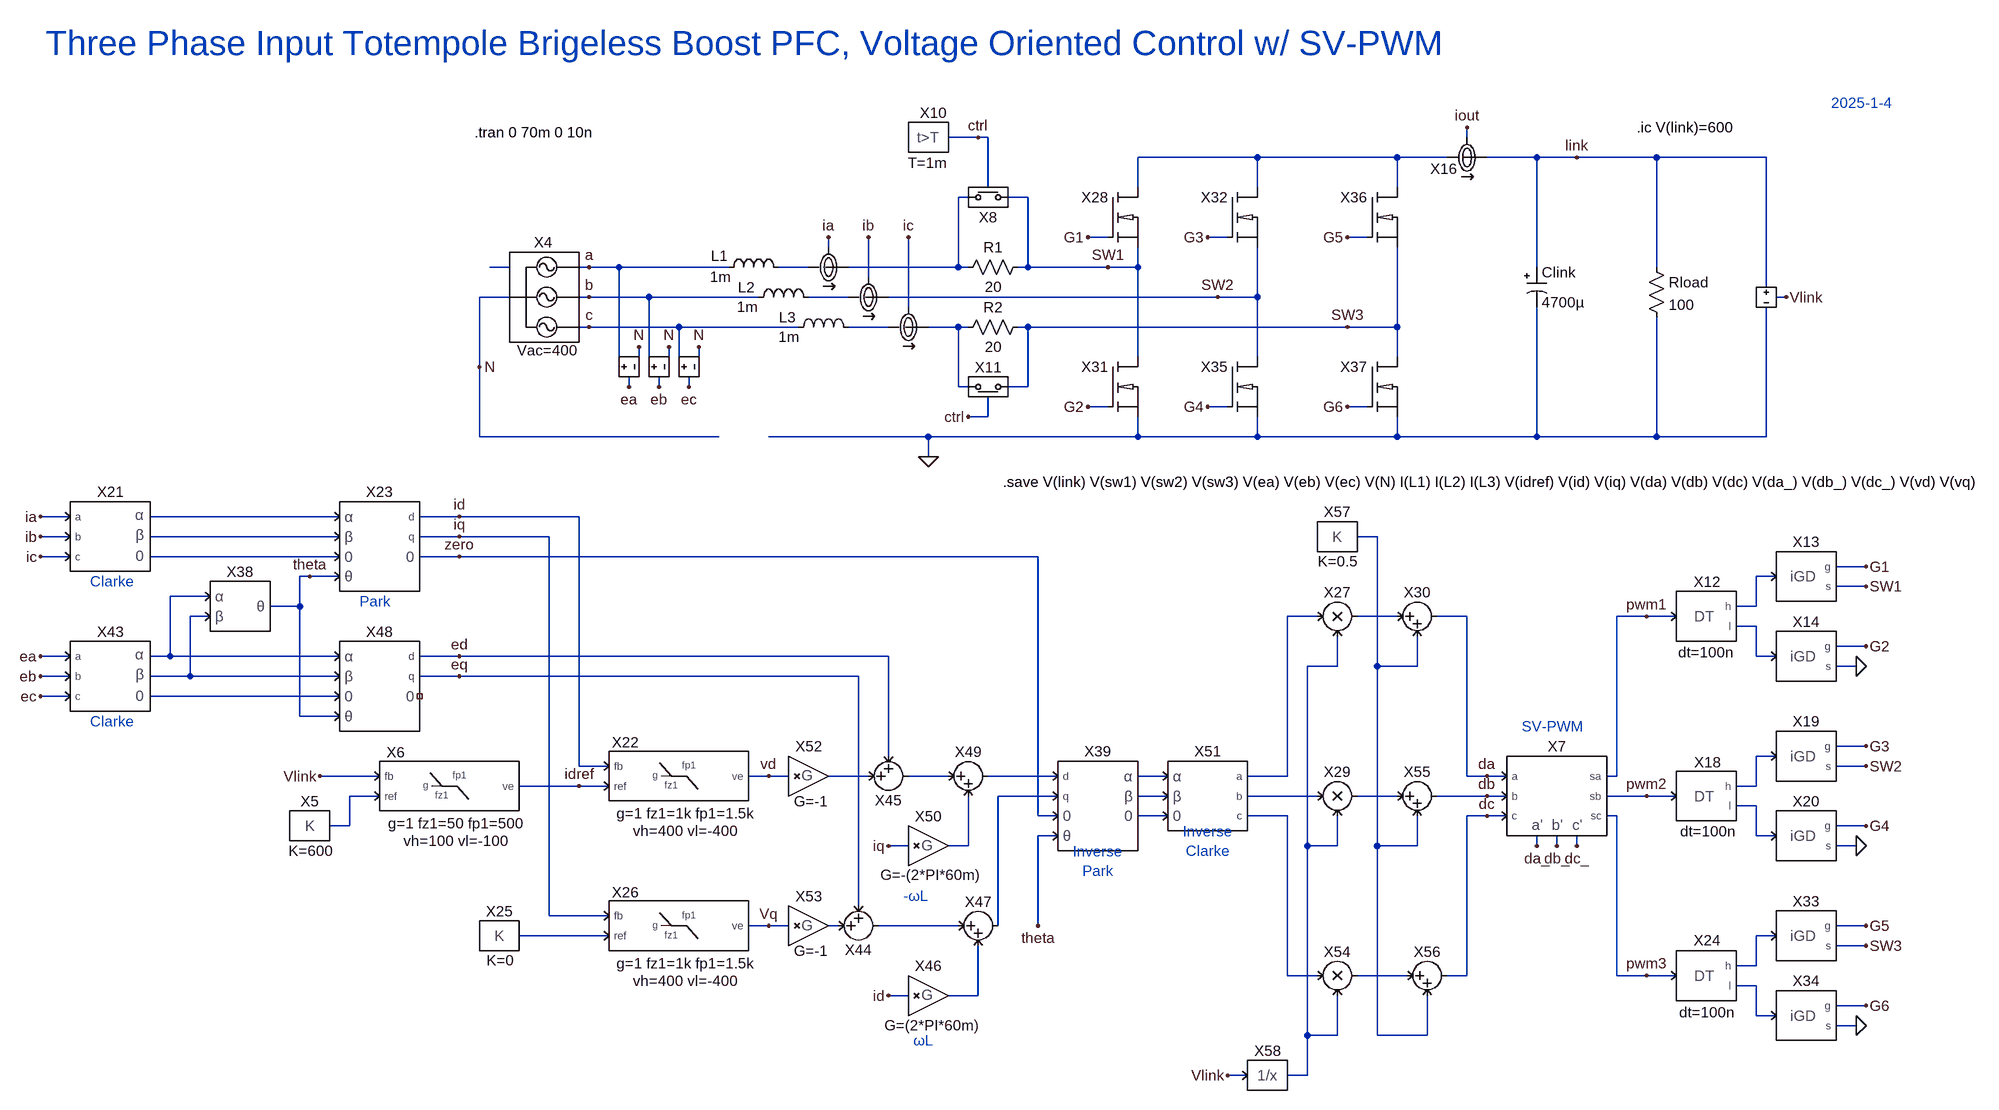
[diagram p0: schematic 3Ph-TTP-PFC_VOC_SVPWM.asc]
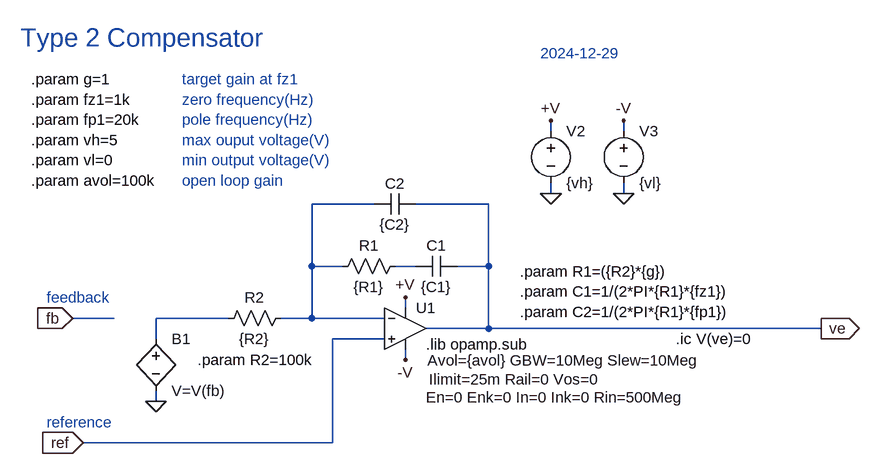
[diagram p1: sub-circuit type2.asc]
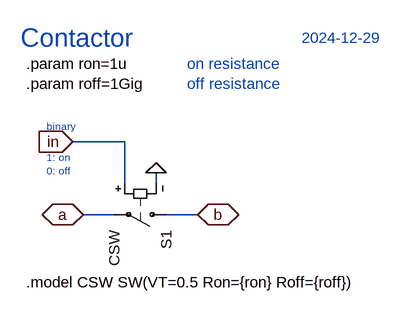
[diagram p2: sub-circuit contactor.asc]
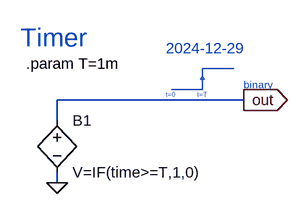
[diagram p3: sub-circuit timer.asc]
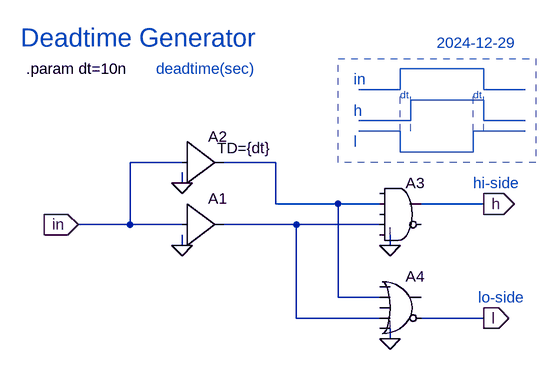
[diagram p4: sub-circuit deadtime.asc]
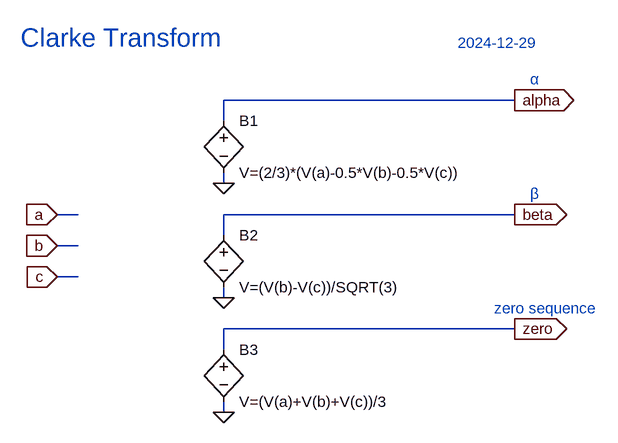
[diagram p5: sub-circuit clarke.asc]
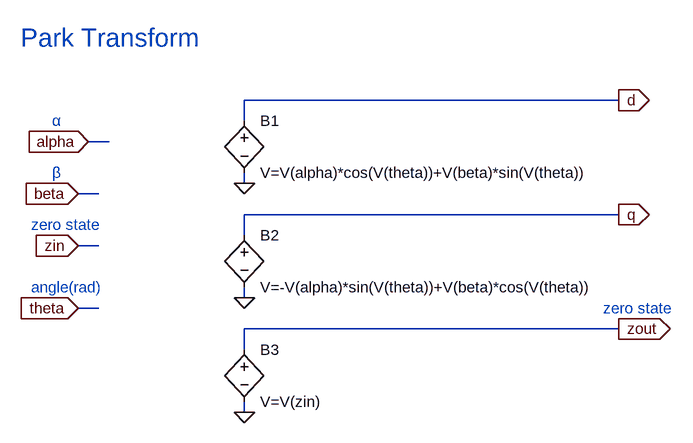
[diagram p6: sub-circuit park.asc]
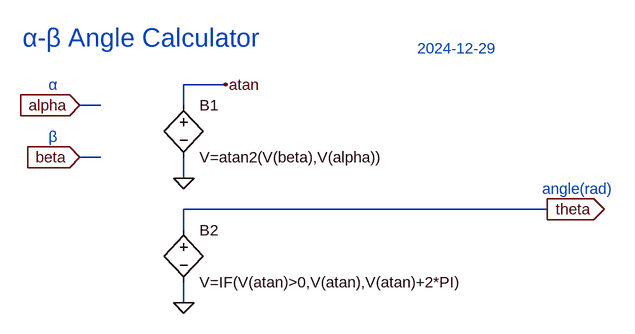
[diagram p7: sub-circuit angle.asc]
3Ph-TTP-PFC_VOC_SVPWM.asc, the LTspice schematic file:
Version 4
SHEET 1 2128 1792
WIRE 368 -48 320 -48
WIRE 384 -48 368 -48
WIRE 1152 -48 1152 -64
WIRE 816 -16 624 -16
WIRE 1040 -16 816 -16
WIRE 1120 -16 1040 -16
WIRE 1264 -16 1184 -16
WIRE 1328 -16 1264 -16
WIRE 1456 -16 1328 -16
WIRE 1632 -16 1456 -16
WIRE 384 32 384 -48
WIRE 624 32 624 -16
WIRE 816 32 816 -16
WIRE 1040 32 1040 -16
WIRE 352 48 336 48
WIRE 448 48 416 48
WIRE 576 112 544 112
WIRE 768 112 736 112
WIRE 992 112 960 112
WIRE 128 128 128 112
WIRE -384 160 -416 160
WIRE -256 160 -272 160
WIRE -208 160 -256 160
WIRE -32 160 -208 160
WIRE 96 160 48 160
WIRE 336 160 336 48
WIRE 336 160 160 160
WIRE 352 160 336 160
WIRE 448 160 448 48
WIRE 448 160 432 160
WIRE 576 160 448 160
WIRE 624 160 624 128
WIRE 624 160 576 160
WIRE 1264 160 1264 -16
WIRE 1456 160 1456 -16
WIRE 192 176 192 112
WIRE 1632 192 1632 -16
WIRE -384 208 -432 208
WIRE -256 208 -272 208
WIRE -160 208 -256 208
WIRE 16 208 -160 208
WIRE 160 208 96 208
WIRE 752 208 224 208
WIRE 816 208 816 128
WIRE 816 208 752 208
WIRE 1664 208 1648 208
WIRE 256 224 256 112
WIRE -256 256 -272 256
WIRE -112 256 -256 256
WIRE 80 256 -112 256
WIRE 224 256 160 256
WIRE 336 256 288 256
WIRE 352 256 336 256
WIRE 448 256 432 256
WIRE 960 256 448 256
WIRE 1040 256 1040 128
WIRE 1040 256 960 256
WIRE 624 304 624 160
WIRE 816 304 816 208
WIRE 1040 304 1040 256
WIRE -432 320 -432 208
WIRE -208 320 -208 160
WIRE -176 320 -176 288
WIRE -160 320 -160 208
WIRE -128 320 -128 288
WIRE -112 320 -112 256
WIRE -80 320 -80 288
WIRE -192 352 -192 336
WIRE -144 352 -144 336
WIRE -96 352 -96 336
WIRE 336 352 336 256
WIRE 352 352 336 352
WIRE 448 352 448 256
WIRE 448 352 416 352
WIRE 576 384 544 384
WIRE 768 384 736 384
WIRE 992 384 960 384
WIRE 384 400 384 368
WIRE 384 400 352 400
WIRE -432 432 -432 320
WIRE -48 432 -432 432
WIRE 288 432 32 432
WIRE 624 432 624 400
WIRE 624 432 288 432
WIRE 816 432 816 400
WIRE 816 432 624 432
WIRE 1040 432 1040 400
WIRE 1040 432 816 432
WIRE 1264 432 1264 224
WIRE 1264 432 1040 432
WIRE 1456 432 1456 240
WIRE 1456 432 1264 432
WIRE 1632 432 1632 224
WIRE 1632 432 1456 432
WIRE 288 464 288 432
WIRE -1088 560 -1136 560
WIRE -656 560 -960 560
WIRE -464 560 -528 560
WIRE -272 560 -464 560
WIRE -1088 592 -1136 592
WIRE -656 592 -960 592
WIRE -464 592 -528 592
WIRE -320 592 -464 592
WIRE 1008 592 976 592
WIRE -1088 624 -1136 624
WIRE -656 624 -960 624
WIRE -464 624 -528 624
WIRE 464 624 -464 624
WIRE 1792 640 1744 640
WIRE -704 656 -720 656
WIRE -656 656 -704 656
WIRE 1648 656 1616 656
WIRE 1792 672 1744 672
WIRE -864 688 -928 688
WIRE -720 704 -720 656
WIRE -720 704 -768 704
WIRE 1616 704 1616 656
WIRE 1616 704 1584 704
WIRE -864 720 -896 720
WIRE 912 720 864 720
WIRE 1040 720 976 720
WIRE 1152 720 1104 720
WIRE 1440 720 1392 720
WIRE 1488 720 1440 720
WIRE 1616 736 1584 736
WIRE 1792 768 1744 768
WIRE -1088 784 -1136 784
WIRE -928 784 -928 688
WIRE -928 784 -960 784
WIRE -656 784 -928 784
WIRE -464 784 -528 784
WIRE 224 784 -464 784
WIRE 1616 784 1616 736
WIRE 1648 784 1616 784
WIRE 944 800 944 752
WIRE 944 800 896 800
WIRE 1008 800 1008 592
WIRE 1072 800 1072 752
WIRE 1072 800 1008 800
WIRE 1776 800 1744 800
WIRE -1088 816 -1136 816
WIRE -896 816 -896 720
WIRE -896 816 -960 816
WIRE -656 816 -896 816
WIRE -464 816 -528 816
WIRE 176 816 -464 816
WIRE -1088 848 -1136 848
WIRE -656 848 -960 848
WIRE -720 880 -720 704
WIRE -656 880 -720 880
WIRE 1792 928 1744 928
WIRE 224 944 224 784
WIRE 1648 944 1616 944
WIRE -272 960 -272 560
WIRE -224 960 -272 960
WIRE 1792 960 1744 960
WIRE -592 976 -688 976
WIRE 32 976 0 976
WIRE 64 976 32 976
WIRE 192 976 128 976
WIRE 320 976 256 976
WIRE 496 976 384 976
WIRE 672 976 624 976
WIRE 864 976 864 720
WIRE 864 976 800 976
WIRE 1152 976 1152 720
WIRE 1184 976 1152 976
WIRE 1216 976 1184 976
WIRE 1392 976 1392 720
WIRE 1392 976 1376 976
WIRE -272 992 -368 992
WIRE -224 992 -272 992
WIRE 1616 992 1616 944
WIRE 1616 992 1584 992
WIRE -592 1008 -640 1008
WIRE 496 1008 400 1008
WIRE 672 1008 624 1008
WIRE 912 1008 800 1008
WIRE 1040 1008 976 1008
WIRE 1184 1008 1104 1008
WIRE 1216 1008 1184 1008
WIRE 1440 1008 1376 1008
WIRE 1488 1008 1440 1008
WIRE 1616 1024 1584 1024
WIRE 464 1040 464 624
WIRE 496 1040 464 1040
WIRE 672 1040 624 1040
WIRE 864 1040 800 1040
WIRE 1184 1040 1152 1040
WIRE 1216 1040 1184 1040
WIRE 1392 1040 1376 1040
WIRE -640 1056 -640 1008
WIRE -640 1056 -672 1056
WIRE 1792 1056 1744 1056
WIRE 496 1072 464 1072
WIRE 1616 1072 1616 1024
WIRE 1648 1072 1616 1072
WIRE 256 1088 224 1088
WIRE 352 1088 352 1008
WIRE 352 1088 320 1088
WIRE 896 1088 896 800
WIRE 944 1088 944 1040
WIRE 944 1088 896 1088
WIRE 1008 1088 1008 800
WIRE 1072 1088 1072 1040
WIRE 1072 1088 1008 1088
WIRE 1264 1088 1264 1072
WIRE 1296 1088 1296 1072
WIRE 1328 1088 1328 1072
WIRE 1776 1088 1744 1088
WIRE 176 1184 176 816
WIRE -320 1200 -320 592
WIRE -224 1200 -320 1200
WIRE 32 1216 0 1216
WIRE 64 1216 32 1216
WIRE 144 1216 128 1216
WIRE 336 1216 208 1216
WIRE 400 1216 400 1008
WIRE 464 1216 464 1072
WIRE 1792 1216 1744 1216
WIRE -224 1232 -368 1232
WIRE 1648 1232 1616 1232
WIRE 1792 1248 1744 1248
WIRE 1616 1280 1616 1232
WIRE 1616 1280 1584 1280
WIRE 864 1296 864 1040
WIRE 912 1296 864 1296
WIRE 1056 1296 976 1296
WIRE 1152 1296 1152 1040
WIRE 1152 1296 1120 1296
WIRE 1392 1296 1392 1040
WIRE 1440 1296 1392 1296
WIRE 1488 1296 1440 1296
WIRE 1616 1312 1584 1312
WIRE 256 1328 224 1328
WIRE 368 1328 368 1248
WIRE 368 1328 320 1328
WIRE 1792 1344 1744 1344
WIRE 1616 1360 1616 1312
WIRE 1648 1360 1616 1360
WIRE 1776 1376 1744 1376
WIRE 896 1392 896 1088
WIRE 944 1392 944 1328
WIRE 944 1392 896 1392
WIRE 1008 1392 1008 1088
WIRE 1088 1392 1088 1328
WIRE 1088 1392 1008 1392
WIRE 800 1456 768 1456
WIRE 896 1456 896 1392
WIRE 896 1456 864 1456
FLAG 544 112 G1
FLAG 544 384 G2
FLAG 576 160 SW1
FLAG 1328 -16 link
FLAG 128 112 ia
FLAG 1664 208 Vlink
FLAG -688 976 Vlink
FLAG 1440 720 pwm1
FLAG 288 464 0
FLAG 1152 -64 iout
FLAG -272 992 idref
FLAG 736 112 G3
FLAG 736 384 G4
FLAG 752 208 SW2
FLAG 960 112 G5
FLAG 960 384 G6
FLAG 960 256 SW3
FLAG 192 112 ib
FLAG 256 112 ic
FLAG -1136 560 ia
FLAG -1136 592 ib
FLAG -1136 624 ic
FLAG -464 560 id
FLAG -464 592 iq
FLAG 1440 1008 pwm2
FLAG 1440 1296 pwm3
FLAG 32 976 vd
FLAG 32 1216 Vq
FLAG -256 160 a
FLAG -256 208 b
FLAG -256 256 c
FLAG -464 624 zero
FLAG -432 320 N
FLAG 368 -48 ctrl
FLAG 352 400 ctrl
FLAG 1792 640 G1
FLAG 1792 672 SW1
FLAG 1792 768 G2
FLAG 1792 928 G3
FLAG 1792 960 SW2
FLAG 1792 1056 G4
FLAG 1792 1216 G5
FLAG 1792 1248 SW3
FLAG 1792 1344 G6
FLAG 1776 800 0
FLAG 1776 1376 0
FLAG 1776 1088 0
FLAG -704 656 theta
FLAG 464 1216 theta
FLAG -192 352 ea
FLAG -144 352 eb
FLAG -96 352 ec
FLAG -176 288 N
FLAG -128 288 N
FLAG -80 288 N
FLAG -1136 784 ea
FLAG -1136 816 eb
FLAG -1136 848 ec
FLAG 224 1328 id
FLAG 224 1088 iq
FLAG -464 784 ed
FLAG -464 816 eq
FLAG 768 1456 Vlink
FLAG 1264 1088 da_
FLAG 1296 1088 db_
FLAG 1328 1088 dc_
FLAG 1184 976 da
FLAG 1184 1008 db
FLAG 1184 1040 dc
SYMBOL ind -48 176 R270
WINDOW 0 19 1 VTop 2
WINDOW 3 16 3 VBottom 2
SYMATTR InstName L1
SYMATTR Value 1m
SYMATTR SpiceLine Rser=1m
SYMBOL polcap 1248 160 R0
WINDOW 3 24 56 Left 2
SYMATTR Value 4700µ
SYMATTR InstName Clink
SYMATTR Description Capacitor
SYMATTR Type cap
SYMATTR SpiceLine Rser=10m
SYMBOL res 1440 144 R0
SYMATTR InstName Rload
SYMATTR Value 100
SYMBOL IMON 128 160 M180
WINDOW 0 0 -26 Invisible 2
SYMATTR InstName X1
SYMBOL VMON 1632 208 R0
WINDOW 0 57 -5 Invisible 2
SYMATTR InstName X2
SYMBOL CONST -704 1056 R0
WINDOW 39 1 55 Bottom 2
SYMATTR SpiceLine K=600
SYMATTR InstName X5
SYMBOL IMON 1152 -16 M180
SYMATTR InstName X16
SYMBOL TYPE2 -480 992 R0
WINDOW 0 -86 -54 Center 2
WINDOW 39 10 60 Center 2
WINDOW 40 10 88 Center 2
SYMATTR InstName X6
SYMATTR SpiceLine g=1 fz1=50 fp1=500
SYMATTR SpiceLine2 vh=100 vl=-100
SYMBOL VAC3ph -320 208 R0
WINDOW 39 -4 101 Bottom 2
SYMATTR SpiceLine Vac=400
SYMATTR InstName X4
SYMBOL ind 0 224 R270
WINDOW 0 16 -4 VTop 2
WINDOW 3 16 -2 VBottom 2
SYMATTR InstName L2
SYMATTR Value 1m
SYMATTR SpiceLine Rser=1m
SYMBOL ind 64 272 R270
WINDOW 0 16 -2 VTop 2
WINDOW 3 16 1 VBottom 2
SYMATTR InstName L3
SYMATTR Value 1m
SYMATTR SpiceLine Rser=1m
SYMBOL IMON 192 208 M180
WINDOW 0 0 -26 Invisible 2
SYMATTR InstName X3
SYMBOL IMON 256 256 M180
WINDOW 0 0 -26 Invisible 2
SYMATTR InstName X17
SYMBOL CONST -400 1232 R0
WINDOW 39 1 55 Bottom 2
SYMATTR SpiceLine K=0
SYMATTR InstName X25
SYMBOL TYPE2 -112 976 R0
WINDOW 0 -86 -54 Center 2
WINDOW 39 10 60 Center 2
WINDOW 40 10 88 Center 2
SYMATTR InstName X22
SYMATTR SpiceLine g=1 fz1=1k fp1=1.5k
SYMATTR SpiceLine2 vh=400 vl=-400
SYMBOL TYPE2 -112 1216 R0
WINDOW 0 -86 -54 Center 2
WINDOW 39 10 60 Center 2
WINDOW 40 10 88 Center 2
SYMATTR InstName X26
SYMATTR SpiceLine g=1 fz1=1k fp1=1.5k
SYMATTR SpiceLine2 vh=400 vl=-400
SYMBOL res 448 144 R90
WINDOW 0 0 56 VBottom 2
WINDOW 3 32 56 VTop 2
SYMATTR InstName R1
SYMATTR Value 20
SYMBOL res 448 240 R90
WINDOW 0 0 56 VBottom 2
WINDOW 3 32 56 VTop 2
SYMATTR InstName R2
SYMATTR Value 20
SYMBOL CONTACTOR 384 32 R0
SYMATTR InstName X8
SYMBOL TIMER 288 -48 R0
WINDOW 39 -1 56 Bottom 2
SYMATTR InstName X10
SYMBOL CONTACTOR 384 368 R180
SYMATTR InstName X11
SYMBOL DEADTIME 1536 720 R0
WINDOW 0 1 -71 Top 2
WINDOW 39 -1 42 Top 2
SYMATTR InstName X12
SYMATTR SpiceLine dt=100n
SYMBOL iGD 1696 656 R0
SYMATTR InstName X13
SYMBOL iGD 1696 784 R0
SYMATTR InstName X14
SYMBOL DEADTIME 1536 1008 R0
WINDOW 0 2 -70 Top 2
WINDOW 39 2 41 Top 2
SYMATTR InstName X18
SYMATTR SpiceLine dt=100n
SYMBOL iGD 1696 944 R0
SYMATTR InstName X19
SYMBOL iGD 1696 1072 R0
SYMATTR InstName X20
SYMBOL DEADTIME 1536 1296 R0
WINDOW 0 1 -72 Top 2
WINDOW 39 1 43 Top 2
SYMATTR InstName X24
SYMATTR SpiceLine dt=100n
SYMBOL iGD 1696 1232 R0
SYMATTR InstName X33
SYMBOL iGD 1696 1360 R0
SYMATTR InstName X34
SYMBOL iNMOS 624 80 R0
SYMATTR InstName X28
SYMBOL iNMOS 624 352 R0
SYMATTR InstName X31
SYMBOL iNMOS 816 80 R0
SYMATTR InstName X32
SYMBOL iNMOS 816 352 R0
SYMATTR InstName X35
SYMBOL iNMOS 1040 80 R0
SYMATTR InstName X36
SYMBOL iNMOS 1040 352 R0
SYMATTR InstName X37
SYMBOL PowerSim\\CLARKE -1024 592 R0
SYMATTR InstName X21
SYMBOL PowerSim\\PARK -592 608 R0
SYMATTR InstName X23
SYMBOL PowerSim\\ANGLE -816 704 R0
SYMATTR InstName X38
SYMBOL VMON -192 320 M90
WINDOW 0 57 -5 Invisible 2
SYMATTR InstName X40
SYMBOL VMON -144 320 M90
WINDOW 0 57 -5 Invisible 2
SYMATTR InstName X41
SYMBOL VMON -96 320 M90
WINDOW 0 57 -5 Invisible 2
SYMATTR InstName X42
SYMBOL PowerSim\\CLARKE -1024 816 R0
SYMATTR InstName X43
SYMBOL PowerSim\\SUM 176 1216 M180
SYMATTR InstName X44
SYMBOL PowerSim\\SUM 224 976 M180
SYMATTR InstName X45
SYMBOL PowerSim\\GAIN 288 1328 R0
WINDOW 39 5 63 Bottom 2
SYMATTR SpiceLine G=(2*PI*60m)
SYMATTR InstName X46
SYMBOL PowerSim\\SUM 368 1216 R0
SYMATTR InstName X47
SYMBOL PowerSim\\PARK -592 832 R0
SYMATTR InstName X48
SYMBOL PowerSim\\SUM 352 976 R0
SYMATTR InstName X49
SYMBOL PowerSim\\GAIN 288 1088 R0
WINDOW 39 3 62 Bottom 2
SYMATTR SpiceLine G=-(2*PI*60m)
SYMATTR InstName X50
SYMBOL PowerSim\\PARKinv 560 1024 R0
SYMATTR InstName X39
SYMBOL PowerSim\\CLARKEinv 736 1008 R0
SYMATTR InstName X51
SYMBOL PowerSim\\GAIN 96 976 R0
WINDOW 39 4 56 Bottom 2
SYMATTR SpiceLine G=-1
SYMATTR InstName X52
SYMBOL PowerSim\\GAIN 96 1216 R0
WINDOW 39 4 56 Bottom 2
SYMATTR SpiceLine G=-1
SYMATTR InstName X53
SYMBOL PowerSim\\MUL 944 1296 R0
SYMATTR InstName X54
SYMBOL PowerSim\\MUL 944 720 R0
SYMATTR InstName X27
SYMBOL PowerSim\\MUL 944 1008 R0
SYMATTR InstName X29
SYMBOL PowerSim\\SUM 1072 720 R0
SYMATTR InstName X30
SYMBOL PowerSim\\SUM 1072 1008 R0
SYMATTR InstName X55
SYMBOL PowerSim\\SUM 1088 1296 R0
SYMATTR InstName X56
SYMBOL CONST 944 592 R0
WINDOW 39 1 55 Bottom 2
SYMATTR SpiceLine K=0.5
SYMATTR InstName X57
SYMBOL PowerSim\\INVERSE 832 1456 R0
SYMATTR InstName X58
SYMBOL PowerSim\\SV_PWM 1296 1008 R0
SYMATTR InstName X7
TEXT -1128 -200 Left 5 ;Three Phase Input Totempole Brigeless Boost PFC, Voltage Oriented Control w/ SV-PWM
TEXT -440 -56 Left 2 !.tran 0 70m 0 10n
TEXT 1424 -64 Left 2 !.ic V(link)=600
TEXT 408 504 Left 2 !.save V(link) V(sw1) V(sw2) V(sw3) V(ea) V(eb) V(ec) V(N) I(L1) I(L2) I(L3) V(idref) V(id) V(iq) V(da) V(db) V(dc) V(da_) V(db_) V(dc_) V(vd) V(vq)
TEXT -1056 664 Left 2 ;Clarke
TEXT -624 696 Left 2 ;Park
TEXT -1056 888 Left 2 ;Clarke
TEXT 1736 -104 Left 2 ;2025-1-4
TEXT 560 1112 Center 2 ;Inverse\nPark
TEXT 736 1080 Center 2 ;Inverse\nClarke
TEXT 264 1400 Left 2 ;ωL
TEXT 248 1168 Left 2 ;-ωL
TEXT 1240 896 Left 2 ;SV-PWM

type2.asc, the sub-circuit schematic file:
Version 4
SHEET 1 1008 680
WIRE 464 -144 464 -160
WIRE 576 -144 576 -160
WIRE 464 -48 464 -64
WIRE 576 -48 576 -64
WIRE 192 -32 96 -32
WIRE 368 -32 256 -32
WIRE 96 64 96 -32
WIRE 144 64 96 64
WIRE 256 64 224 64
WIRE 368 64 368 -32
WIRE 368 64 320 64
WIRE 240 128 240 112
WIRE -208 144 -272 144
WIRE -32 144 -144 144
WIRE 96 144 96 64
WIRE 96 144 48 144
WIRE 208 144 96 144
WIRE 368 160 368 64
WIRE 368 160 272 160
WIRE 880 160 368 160
WIRE -144 176 -144 144
WIRE 208 176 128 176
WIRE 240 208 240 192
WIRE -144 272 -144 256
WIRE 128 336 128 176
WIRE 128 336 -256 336
FLAG -272 144 fb
IOPIN -272 144 In
FLAG -256 336 ref
IOPIN -256 336 In
FLAG -144 272 0
FLAG 880 160 ve
IOPIN 880 160 Out
FLAG 576 -48 0
FLAG 464 -48 0
FLAG 464 -160 +V
FLAG 576 -160 -V
FLAG 240 112 +V
FLAG 240 208 -V
SYMBOL res 240 48 R90
WINDOW 0 0 56 VBottom 2
WINDOW 3 32 56 VTop 2
SYMATTR InstName R1
SYMATTR Value {R1}
SYMBOL cap 320 48 R90
WINDOW 0 0 32 VBottom 2
WINDOW 3 32 32 VTop 2
SYMATTR InstName C1
SYMATTR Value {C1}
SYMBOL cap 256 -48 R90
WINDOW 0 0 32 VBottom 2
WINDOW 3 32 32 VTop 2
SYMATTR InstName C2
SYMATTR Value {C2}
SYMBOL bv -144 160 R0
SYMATTR InstName B1
SYMATTR Value V=V(fb)
SYMBOL res 64 128 R90
WINDOW 0 0 56 VBottom 2
WINDOW 3 32 56 VTop 2
SYMATTR InstName R2
SYMATTR Value {R2}
SYMBOL UniversalOpAmp2 240 160 R0
WINDOW 123 34 49 Left 2
WINDOW 39 36 78 Left 2
WINDOW 40 32 106 Left 2
SYMATTR Value2 Avol={avol} GBW=10Meg Slew=10Meg
SYMATTR InstName U1
SYMBOL voltage 464 -160 R0
SYMATTR InstName V2
SYMATTR Value {vh}
SYMBOL voltage 576 -160 R0
SYMATTR InstName V3
SYMATTR Value {vl}
TEXT 272 184 Left 2 !.lib opamp.sub
TEXT -336 -224 Left 2 !.param g=1\n.param fz1=1k\n.param fp1=20k\n.param vh=5\n.param vl=0\n.param avol=100k
TEXT 416 72 Left 2 !.param R1=({R2}*{g})\n.param C1=1/(2*PI*{R1}*{fz1})\n.param C2=1/(2*PI*{R1}*{fp1})
TEXT -352 -288 Left 4 ;Type 2 Compensator
TEXT -80 208 Left 2 !.param R2=100k
TEXT -104 -224 Left 2 ;target gain at fz1\nzero frequency(Hz)\npole frequency(Hz)\nmax ouput voltage(V)\nmin output voltage(V)\nopen loop gain
TEXT -312 112 Left 2 ;feedback
TEXT -312 304 Left 2 ;reference
TEXT 656 176 Left 2 !.ic V(ve)=0
TEXT 448 -264 Left 2 ;2024-12-29

contactor.asc, the sub-circuit schematic file:
Version 4
SHEET 1 1504 680
WIRE 416 128 336 128
WIRE 416 192 416 128
WIRE 464 192 464 176
WIRE 400 240 352 240
WIRE 528 240 480 240
FLAG 352 240 a
IOPIN 352 240 BiDir
FLAG 528 240 b
IOPIN 528 240 BiDir
FLAG 336 128 in
IOPIN 336 128 In
FLAG 464 176 0
SYMBOL sw 496 240 R90
SYMATTR InstName S1
SYMATTR Value CSW
SYMATTR Prefix SW
TEXT 264 8 Left 2 !.param ron=1u\n.param roff=1Gig
TEXT 264 344 Left 2 !.model CSW SW(VT=0.5 Ron={ron} Roff={roff})
TEXT 256 -32 Left 4 ;Contactor
TEXT 512 8 Left 2 ;on resistance\noff resistance
TEXT 296 104 Left 1 ;binary
TEXT 296 152 Left 1 ;1: on\n0: off
TEXT 688 -32 Left 2 ;2024-12-29

timer.asc, the sub-circuit schematic file:
Version 4
SHEET 1 1328 680
WIRE 1008 -128 720 -128
WIRE 720 -96 720 -128
WIRE 720 0 720 -16
FLAG 1008 -128 out
IOPIN 1008 -128 Out
FLAG 720 0 0
SYMBOL bv 720 -112 R0
SYMATTR InstName B1
SYMATTR Value V=IF(time>=T,1,0)
TEXT 672 -184 Left 2 !.param T=1m
TEXT 664 -224 Left 4 ;Timer
TEXT 1008 -152 Left 1 ;binary
TEXT 888 -136 Left 0 ;t=0
TEXT 936 -136 Left 0 ;t=T
TEXT 888 -208 Left 2 ;2024-12-29
LINE Normal 944 -144 896 -144
LINE Normal 944 -176 944 -144
LINE Normal 992 -176 944 -176
LINE Normal 947 -159 944 -163
LINE Normal 941 -159 944 -163

deadtime.asc, the sub-circuit schematic file:
Version 4
SHEET 1 1412 1312
WIRE 64 288 -16 288
WIRE 208 288 128 288
WIRE 64 320 64 304
WIRE 208 352 208 288
WIRE 304 352 208 352
WIRE 368 352 304 352
WIRE 528 352 432 352
WIRE -16 384 -16 288
WIRE -16 384 -96 384
WIRE 64 384 -16 384
WIRE 240 384 128 384
WIRE 368 384 240 384
WIRE 64 416 64 400
WIRE 384 416 384 400
WIRE 304 496 304 352
WIRE 368 496 304 496
WIRE 240 528 240 384
WIRE 368 528 240 528
WIRE 528 528 432 528
WIRE 384 560 384 544
FLAG -96 384 in
IOPIN -96 384 In
FLAG 64 416 0
FLAG 64 320 0
FLAG 384 416 0
FLAG 384 560 0
FLAG 528 352 h
IOPIN 528 352 Out
FLAG 528 528 l
IOPIN 528 528 Out
SYMBOL Digital\\buf1 64 320 R0
SYMATTR InstName A1
SYMBOL Digital\\buf1 64 224 R0
WINDOW 3 54 42 Left 2
SYMATTR Value TD={dt}
SYMATTR InstName A2
SYMBOL Digital\\and 400 304 R0
SYMATTR InstName A3
SYMBOL Digital\\or 400 448 R0
SYMATTR InstName A4
TEXT -176 144 Left 2 !.param dt=10n
TEXT -184 96 Left 4 ;Deadtime Generator
TEXT 24 144 Left 2 ;deadtime(sec)
TEXT 512 320 Left 2 ;hi-side
TEXT 520 496 Left 2 ;lo-side
TEXT 328 160 Left 2 ;in
TEXT 328 208 Left 2 ;h
TEXT 328 256 Left 2 ;l
TEXT 400 184 Left 1 ;dt
TEXT 512 184 Left 1 ;dt
TEXT 456 104 Left 2 ;2024-12-29
LINE Normal 400 176 336 176
LINE Normal 400 176 400 144
LINE Normal 528 144 400 144
LINE Normal 528 176 528 144
LINE Normal 592 176 528 176
LINE Normal 416 224 336 224
LINE Normal 416 224 416 192
LINE Normal 528 192 416 192
LINE Normal 528 224 528 192
LINE Normal 592 224 528 224
LINE Normal 400 240 336 240
LINE Normal 400 272 400 240
LINE Normal 512 272 400 272
LINE Normal 512 272 512 240
LINE Normal 592 240 512 240
LINE Normal 400 240 400 176 2
LINE Normal 512 240 512 176 2
LINE Normal 416 240 416 176 2
LINE Normal 528 240 528 176 2
RECTANGLE Normal 608 288 304 128 2

clarke.asc, the sub-circuit schematic file:
Version 4
SHEET 1 880 680
WIRE 464 96 16 96
WIRE 16 128 16 96
WIRE 16 224 16 208
WIRE -208 272 -240 272
WIRE 464 272 16 272
WIRE 16 304 16 272
WIRE -208 320 -240 320
WIRE -208 368 -240 368
WIRE 16 400 16 384
WIRE 464 448 16 448
WIRE 16 480 16 448
WIRE 16 576 16 560
FLAG 16 224 0
FLAG 464 96 alpha
IOPIN 464 96 Out
FLAG -240 272 a
IOPIN -240 272 In
FLAG -240 320 b
IOPIN -240 320 In
FLAG -240 368 c
IOPIN -240 368 In
FLAG 16 400 0
FLAG 464 272 beta
IOPIN 464 272 Out
FLAG 16 576 0
FLAG 464 448 zero
IOPIN 464 448 Out
SYMBOL bv 16 112 R0
SYMATTR InstName B1
SYMATTR Value V=(2/3)*(V(a)-0.5*V(b)-0.5*V(c))
SYMBOL bv 16 288 R0
SYMATTR InstName B2
SYMATTR Value V=(V(b)-V(c))/SQRT(3)
SYMBOL bv 16 464 R0
SYMATTR InstName B3
SYMATTR Value V=(V(a)+V(b)+V(c))/3
TEXT -296 0 Left 4 ;Clarke Transform
TEXT 432 416 Left 2 ;zero sequence
TEXT 488 64 Left 2 ;α
TEXT 488 240 Left 2 ;β
TEXT 376 8 Left 2 ;2024-12-29

park.asc, the sub-circuit schematic file:
Version 4
SHEET 1 880 680
WIRE 592 96 16 96
WIRE 16 128 16 96
WIRE -192 160 -224 160
WIRE 16 224 16 208
WIRE -208 240 -240 240
WIRE 592 272 16 272
WIRE 16 304 16 272
WIRE -208 320 -240 320
WIRE 16 400 16 384
WIRE -208 416 -240 416
WIRE 592 448 16 448
WIRE 16 480 16 448
WIRE 16 576 16 560
FLAG 16 224 0
FLAG 592 96 d
IOPIN 592 96 Out
FLAG -224 160 alpha
IOPIN -224 160 In
FLAG -240 320 zin
IOPIN -240 320 In
FLAG 16 400 0
FLAG 592 272 q
IOPIN 592 272 Out
FLAG 16 576 0
FLAG 592 448 zout
IOPIN 592 448 Out
FLAG -240 416 theta
IOPIN -240 416 In
FLAG -240 240 beta
IOPIN -240 240 In
SYMBOL bv 16 112 R0
SYMATTR InstName B1
SYMATTR Value V=V(alpha)*cos(V(theta))+V(beta)*sin(V(theta))
SYMBOL bv 16 288 R0
SYMATTR InstName B2
SYMATTR Value V=-V(alpha)*sin(V(theta))+V(beta)*cos(V(theta))
SYMBOL bv 16 464 R0
SYMATTR InstName B3
SYMATTR Value V=V(zin)
TEXT -328 0 Left 4 ;Park Transform
TEXT -280 128 Left 2 ;α
TEXT -280 208 Left 2 ;β
TEXT -312 288 Left 2 ;zero state
TEXT -312 384 Left 2 ;angle(rad)
TEXT 568 416 Left 2 ;zero state

angle.asc, the sub-circuit schematic file:
Version 4
SHEET 1 880 680
WIRE -176 48 -240 48
WIRE -368 80 -400 80
WIRE -240 80 -240 48
WIRE -368 160 -400 160
WIRE -240 192 -240 160
WIRE 320 240 -240 240
WIRE -240 272 -240 240
WIRE -240 384 -240 352
FLAG -240 192 0
FLAG -176 48 atan
FLAG -240 384 0
FLAG 320 240 theta
IOPIN 320 240 Out
FLAG -400 80 alpha
IOPIN -400 80 In
FLAG -400 160 beta
IOPIN -400 160 In
SYMBOL bv -240 64 R0
SYMATTR InstName B1
SYMATTR Value V=atan2(V(beta),V(alpha))
SYMBOL bv -240 256 R0
SYMATTR InstName B2
SYMATTR Value V=IF(V(atan)>0,V(atan),V(atan)+2*PI)
TEXT -448 48 Left 2 ;α
TEXT -448 128 Left 2 ;β
TEXT -488 -24 Left 4 ;α-β Angle Calculator
TEXT 312 208 Left 2 ;angle(rad)
TEXT 120 -8 Left 2 ;2024-12-29

sum.asc, the sub-circuit schematic file:
Version 4
SHEET 1 880 680
WIRE 288 96 208 96
WIRE 208 112 208 96
WIRE 96 128 48 128
WIRE 96 176 48 176
WIRE 208 208 208 192
FLAG 48 128 IN1
IOPIN 48 128 In
FLAG 48 176 IN2
IOPIN 48 176 In
FLAG 208 208 0
FLAG 288 96 OUT
IOPIN 288 96 Out
SYMBOL bv 208 96 R0
SYMATTR InstName B1
SYMATTR Value V=V(IN1)+V(IN2)
TEXT -16 32 Left 4 ;SUM
TEXT 200 40 Left 2 ;2024-12-29

gain.asc, the sub-circuit schematic file:
Version 4
SHEET 1 880 680
WIRE 0 64 -48 64
WIRE 240 64 144 64
WIRE 144 96 144 64
WIRE 144 192 144 176
FLAG 144 192 0
FLAG 240 64 out
IOPIN 240 64 Out
FLAG -48 64 in
IOPIN -48 64 In
SYMBOL bv 144 80 R0
WINDOW 3 23 92 Left 2
SYMATTR Value V={G}*V(in)
SYMATTR InstName B1
TEXT -88 8 Left 2 !.param G=1
TEXT -88 -40 Left 4 ;GAIN
TEXT 144 -32 Left 2 ;2024-12-29

parkinv.asc, the sub-circuit schematic file:
Version 4
SHEET 1 880 680
WIRE 592 96 16 96
WIRE 16 128 16 96
WIRE -192 160 -224 160
WIRE 16 224 16 208
WIRE -208 240 -240 240
WIRE 592 272 16 272
WIRE 16 304 16 272
WIRE -208 320 -240 320
WIRE 16 400 16 384
WIRE -208 416 -240 416
WIRE 592 448 16 448
WIRE 16 480 16 448
WIRE 16 576 16 560
FLAG 16 224 0
FLAG 592 96 alpha
IOPIN 592 96 Out
FLAG -224 160 d
IOPIN -224 160 In
FLAG -240 320 zin
IOPIN -240 320 In
FLAG 16 400 0
FLAG 592 272 beta
IOPIN 592 272 Out
FLAG 16 576 0
FLAG 592 448 zout
IOPIN 592 448 Out
FLAG -240 416 theta
IOPIN -240 416 In
FLAG -240 240 q
IOPIN -240 240 In
SYMBOL bv 16 112 R0
SYMATTR InstName B1
SYMATTR Value V=V(d)*cos(V(theta))-V(q)*sin(V(theta))
SYMBOL bv 16 288 R0
SYMATTR InstName B2
SYMATTR Value V=V(d)*sin(V(theta))+V(q)*cos(V(theta))
SYMBOL bv 16 464 R0
SYMATTR InstName B3
SYMATTR Value V=V(zin)
TEXT -328 0 Left 4 ;Inverse Park Transform
TEXT -312 288 Left 2 ;zero state
TEXT -312 384 Left 2 ;angle(rad)
TEXT 568 416 Left 2 ;zero state

clarkeinv.asc, the sub-circuit schematic file:
Version 4
SHEET 1 880 680
WIRE 528 80 -112 80
WIRE -112 112 -112 80
WIRE -224 128 -256 128
WIRE -224 176 -256 176
WIRE -112 208 -112 192
WIRE -224 224 -256 224
WIRE 528 256 -112 256
WIRE -112 288 -112 256
WIRE -112 384 -112 368
WIRE 528 432 -112 432
WIRE -112 464 -112 432
WIRE -112 560 -112 544
FLAG -112 208 0
FLAG 528 80 a
IOPIN 528 80 Out
FLAG -256 128 alpha
IOPIN -256 128 In
FLAG -256 176 beta
IOPIN -256 176 In
FLAG -256 224 zero
IOPIN -256 224 In
FLAG -112 384 0
FLAG 528 256 b
IOPIN 528 256 Out
FLAG -112 560 0
FLAG 528 432 c
IOPIN 528 432 Out
SYMBOL bv -112 96 R0
SYMATTR InstName B1
SYMATTR Value V=V(alpha)+V(zero)
SYMBOL bv -112 272 R0
SYMATTR InstName B2
SYMATTR Value V=-0.5*V(alpha)+0.5*SQRT(3)*V(beta)+V(zero)
SYMBOL bv -112 448 R0
SYMATTR InstName B3
SYMATTR Value V=-0.5*V(alpha)-0.5*SQRT(3)*V(beta)+V(zero)
TEXT -368 0 Left 4 ;Inverse Clarke Transform
TEXT 312 8 Left 2 ;2024-12-29

mul.asc, the sub-circuit schematic file:
Version 4
SHEET 1 880 680
WIRE 96 48 48 48
WIRE 320 48 240 48
WIRE 96 64 96 48
WIRE 240 64 240 48
WIRE 96 160 96 144
WIRE 240 160 240 144
WIRE 96 208 48 208
WIRE 96 224 96 208
WIRE 96 320 96 304
FLAG 48 48 IN1
IOPIN 48 48 In
FLAG 48 208 IN2
IOPIN 48 208 In
FLAG 240 160 0
FLAG 320 48 OUT
IOPIN 320 48 Out
FLAG 96 160 0
FLAG 96 320 0
SYMBOL bv 240 48 R0
SYMATTR InstName B1
SYMATTR Value V=V(IN1)*V(IN2)
SYMBOL res 80 48 R0
SYMATTR InstName R1
SYMATTR Value 1Meg
SYMBOL res 80 208 R0
SYMATTR InstName R2
SYMATTR Value 1Meg
TEXT -16 -56 Left 4 ;Multiplier

inverse.asc, the sub-circuit schematic file:
Version 4
SHEET 1 1360 680
WIRE 672 144 192 144
WIRE 1264 144 672 144
WIRE 672 160 672 144
WIRE 192 176 192 144
WIRE 80 208 32 208
WIRE 672 240 672 224
WIRE 192 288 192 256
FLAG 32 208 in
IOPIN 32 208 In
FLAG 192 288 0
FLAG 1264 144 out
IOPIN 1264 144 Out
FLAG 672 240 0
SYMBOL bv 192 160 R0
WINDOW 3 37 125 Left 2
SYMATTR Value V=IF(V(in)>0,IF(V(in)>(1/{vsat}),1/V(in),{vsat}),IF(V(in)>(-1/{vsat}),-{vsat},1/V(in)))
SYMATTR InstName B1
SYMBOL cap 656 160 R0
SYMATTR InstName C1
SYMATTR Value 10p
SYMATTR SpiceLine Rser=1k
TEXT -32 16 Left 4 ;Inverse
TEXT 1168 8 Left 2 ;2025-2-23
TEXT -24 64 Left 2 !.param vsat=1k
TEXT 224 64 Left 2 ;saturation voltage
TEXT 120 400 Left 2 ;<Revision History>\n2025-01-03: Initial Versoin.\n2025-02-23: Added RC snubber(10pF-1kohm) at output to reduce spike

sv_pwm.asc, the sub-circuit schematic file:
Version 4.1
SHEET 1 2540 1384
WIRE 720 464 624 464
WIRE 1264 464 1168 464
WIRE 1824 464 1824 432
WIRE 1824 464 1264 464
WIRE 1952 464 1824 464
WIRE 2160 464 2048 464
WIRE 384 496 368 496
WIRE 624 496 624 464
WIRE 1168 496 1168 464
WIRE 384 544 368 544
WIRE 384 592 368 592
WIRE 624 592 624 576
WIRE 1168 592 1168 576
WIRE 1264 640 1168 640
WIRE 1824 640 1824 608
WIRE 1824 640 1264 640
WIRE 1952 640 1824 640
WIRE 2160 640 2048 640
WIRE 720 656 624 656
WIRE 1168 672 1168 640
WIRE 624 688 624 656
WIRE 1168 768 1168 752
WIRE 624 784 624 768
WIRE 1248 848 1152 848
WIRE 1824 848 1824 816
WIRE 1824 848 1248 848
WIRE 1952 848 1824 848
WIRE 2160 848 2048 848
WIRE 720 880 624 880
WIRE 1152 880 1152 848
WIRE 624 912 624 880
WIRE 1152 976 1152 960
WIRE 624 1008 624 992
WIRE 720 1104 624 1104
WIRE 624 1136 624 1104
WIRE 624 1232 624 1216
FLAG 368 496 a
IOPIN 368 496 In
FLAG 368 544 b
IOPIN 368 544 In
FLAG 368 592 c
IOPIN 368 592 In
FLAG 624 592 0
FLAG 720 464 min
FLAG 624 784 0
FLAG 720 656 max
FLAG 624 1008 0
FLAG 720 880 vcm
FLAG 1168 592 0
FLAG 1264 464 a2
FLAG 1168 768 0
FLAG 1264 640 b2
FLAG 1152 976 0
FLAG 1248 848 c2
FLAG 624 1232 0
FLAG 720 1104 z
FLAG 2160 464 sa
IOPIN 2160 464 Out
FLAG 2160 640 sb
IOPIN 2160 640 Out
FLAG 2160 848 sc
IOPIN 2160 848 Out
FLAG 1824 432 a_
IOPIN 1824 432 Out
FLAG 1824 608 b_
IOPIN 1824 608 Out
FLAG 1824 816 c_
IOPIN 1824 816 Out
SYMBOL bv 624 480 R0
SYMATTR InstName B1
SYMATTR Value V=min(min(V(a),V(b)),V(c))
SYMBOL bv 624 672 R0
SYMATTR InstName B2
SYMATTR Value V=max(max(V(a),V(b)),V(c))
SYMBOL bv 624 896 R0
SYMATTR InstName B3
SYMATTR Value V=(V(min)+V(max))/2
SYMBOL bv 1168 480 R0
SYMATTR InstName B4
SYMATTR Value V=(V(a)-V(vcm))*IF(ug==1,1,2/SQRT(3))+V(z)
SYMBOL bv 1168 656 R0
SYMATTR InstName B5
SYMATTR Value V=(V(b)-V(vcm))*IF(ug==1,1,2/SQRT(3))+V(z)
SYMBOL bv 1152 864 R0
SYMATTR InstName B6
SYMATTR Value V=(V(c)-V(vcm))*IF(ug==1,1,2/SQRT(3))+V(z)
SYMBOL bv 624 1120 R0
SYMATTR InstName B7
SYMATTR Value V=(V(a)+V(b)+V(c))/3
SYMBOL PowerSim\\PWM 2000 464 R0
WINDOW 39 10 56 Bottom 2
SYMATTR SpiceLine freq={freq}
SYMATTR InstName X1
SYMBOL PowerSim\\PWM 2000 640 R0
WINDOW 39 10 56 Bottom 2
SYMATTR SpiceLine freq={freq}
SYMATTR InstName X2
SYMBOL PowerSim\\PWM 2000 848 R0
WINDOW 39 10 56 Bottom 2
SYMATTR SpiceLine freq={freq}
SYMATTR InstName X3
TEXT 360 304 Left 4 ;SV_PWM
TEXT 1976 320 Left 2 ;2026-09-21
TEXT 512 368 Left 2 !.param freq=10k\n.param ug=0
TEXT 752 368 Left 2 ;switching frequency
TEXT 752 400 Left 2 ;0: gain = 2/sqrt(3) (default), 1: gain = 1
TEXT 592 1312 Left 2 ;<Revision History>\n2025-01-04: Initial version\n2026-09-21: Added ug parameter to select unity gain (ug=1) or retain the original 2/sqrt(3) scaling (ug=0, default).

pwm.asc, the sub-circuit schematic file:
Version 4.1
SHEET 1 1668 1312
WIRE 32 64 -96 64
WIRE 432 80 416 80
WIRE 480 80 432 80
WIRE 576 80 480 80
WIRE 704 80 640 80
WIRE 480 96 480 80
WIRE 576 112 576 96
WIRE 32 160 -96 160
WIRE 480 208 480 176
WIRE -96 272 -96 160
WIRE -96 384 -96 352
FLAG -96 64 duty
IOPIN -96 64 In
FLAG 704 80 pwm
IOPIN 704 80 Out
FLAG 480 208 0
FLAG 432 80 c
FLAG 576 112 0
FLAG -96 384 0
FLAG -96 160 saw
SYMBOL res 464 80 R0
SYMATTR InstName R2
SYMATTR Value 1k
SYMBOL Digital\\buf1 576 16 R0
SYMATTR InstName A1
SYMBOL voltage -96 256 R0
WINDOW 123 0 0 Left 0
WINDOW 39 0 0 Left 0
SYMATTR InstName V1
SYMATTR Value PULSE(0 1 {phase/(360*freq)} {IF(tri==0,1/freq-1n,1/(2*freq))} {IF(tri==0,0.5n,1/(2*freq))} {IF(tri==0,0.5n,0)} {1/freq})
TEXT 72 32 Left 2 !.machine\n.state LO 0\n.state HI 1\n.rule HI LO V(saw)>V(duty)\n.rule LO HI V(saw)< V(duty)\n.output (c) state\n.endmachine
TEXT -144 -120 Left 2 !.param freq=100k
TEXT 624 120 Left 2 !.ic V(pwm)=0
TEXT -144 -88 Left 2 !.param phase=0
TEXT -144 -168 Left 4 ;Pulse Width Modulator
TEXT 464 -168 Left 2 ;2026-09-21
TEXT 104 -120 Left 2 ;frequency(Hz)
TEXT -144 -56 Left 2 !.param tri=0
TEXT 104 -56 Left 2 ;0: Saw, 1; Triangular
TEXT 104 -88 Left 2 ;phase(deg)
TEXT -96 448 Left 2 ;<Revision History>\n2024-12-29: Initial version\n2026-09-21: Added tri parameter to select a triangular carrier (tri=1) or retain the original sawtooth carrier (tri=0, default).
RECTANGLE Normal 416 240 32 0 2

The netlist it stands for:
* 3Ph-TTP-PFC_VOC_SVPWM.asc
L1 a N004 1m Rser=1m
Clink link 0 4700µ Rser=10m
Rload link 0 100
XX1 N002 ia N004 IMON rsns=10u  ; pins n out p
XX2 0 Vlink link VMON  ; pins n out p
XX5 N025 CONST K=600  ; pins K
XX16 link iout N001 IMON rsns=10u  ; pins n out p
XX6 Vlink N025 idref type2 params: avol=100k g=1 fz1=50 fp1=500 vh=100 vl=-100
XX4 N a b c VAC3ph params: type=0 Vac=400 freq=60  ; pins n U V W
L2 b N005 1m Rser=1m
L3 c N006 1m Rser=1m
XX3 SW2 ib N005 IMON rsns=10u  ; pins n out p
XX17 N007 ic N006 IMON rsns=10u  ; pins n out p
XX25 N036 CONST K=0  ; pins K
XX22 id idref vd type2 params: avol=100k g=1 fz1=1k fp1=1.5k vh=400 vl=-400
XX26 iq N036 Vq type2 params: avol=100k g=1 fz1=1k fp1=1.5k vh=400 vl=-400
R1 SW1 N002 20
R2 SW3 N007 20
XX8 ctrl N002 SW1 contactor params: ron=1u roff=1Gig
XX10 ctrl timer params: T=1m
XX11 ctrl SW3 N007 contactor params: ron=1u roff=1Gig
XX12 pwm1 N017 N012 deadtime params: dt=100n
XX13 N012 G1 SW1 iGD  ; pins in g s
XX14 N017 G2 0 iGD  ; pins in g s
XX18 pwm2 N030 N020 deadtime params: dt=100n
XX19 N020 G3 SW2 iGD  ; pins in g s
XX20 N030 G4 0 iGD  ; pins in g s
XX24 pwm3 N039 N037 deadtime params: dt=100n
XX33 N037 G5 SW3 iGD  ; pins in g s
XX34 N039 G6 0 iGD  ; pins in g s
XX28 N001 G1 SW1 iNMOS params: esl=1f rsnb=1k csnb=10p ron=10m  ; pins D G S
XX31 SW1 G2 0 iNMOS params: esl=1f rsnb=1k csnb=10p ron=10m  ; pins D G S
XX32 N001 G3 SW2 iNMOS params: esl=1f rsnb=1k csnb=10p ron=10m  ; pins D G S
XX35 SW2 G4 0 iNMOS params: esl=1f rsnb=1k csnb=10p ron=10m  ; pins D G S
XX36 N001 G5 SW3 iNMOS params: esl=1f rsnb=1k csnb=10p ron=10m  ; pins D G S
XX37 SW3 G6 0 iNMOS params: esl=1f rsnb=1k csnb=10p ron=10m  ; pins D G S
XX21 ia ib ic N008 N009 N011 clarke
XX23 N008 N009 theta N011 id iq zero park
XX38 N013 N014 theta angle
XX40 N ea a VMON  ; pins n out p
XX41 N eb b VMON  ; pins n out p
XX42 N ec c VMON  ; pins n out p
XX43 ea eb ec N013 N014 N019 clarke
XX44 N034 eq N035 sum
XX45 N021 ed N022 sum
XX46 id N040 gain params: G=(2*PI*60m)
XX47 N035 N040 N026 sum
XX48 N013 N014 theta N019 ed eq NC_01 park
XX49 N022 N033 N023 sum
XX50 iq N033 gain params: G=-(2*PI*60m)
XX39 N023 N026 theta zero N024 N027 N031 parkinv
XX51 N024 N027 N031 N015 N028 N032 clarkeinv
XX52 vd N021 gain params: G=-1
XX53 Vq N034 gain params: G=-1
XX54 N032 N018 N038 mul
XX27 N015 N018 N016 mul
XX29 N028 N018 N029 mul
XX30 N016 N010 da sum
XX55 N029 N010 db sum
XX56 N038 N010 dc sum
XX57 N010 CONST K=0.5  ; pins K
XX58 Vlink N018 inverse
XX7 da db dc da_ db_ dc_ pwm1 pwm2 pwm3 sv_pwm params: freq=10k ug=0

* block symbol definitions
.subckt type2 fb ref ve
R1 N002 N001 {R1}
C1 ve N002 {C1}
C2 ve N001 {C2}
B1 N003 0 V=V(fb)
R2 N001 N003 {R2}
XU1 ref N001 +V -V ve level2 Avol={avol} GBW=10Meg Slew=10Meg Ilimit=25m Rail=0 Vos=0 En=0 Enk=0 In=0 Ink=0 Rin=500Meg  ; pins In+ In- V+ V- OUT
V2 +V 0 {vh}
V3 -V 0 {vl}
.lib opamp.sub
.param g=1
.param fz1=1k
.param fp1=20k
.param vh=5
.param vl=0
.param avol=100k
.param R1=({R2}*{g})
.param C1=1/(2*PI*{R1}*{fz1})
.param C2=1/(2*PI*{R1}*{fp1})
* Type 2 Compensator
.param R2=100k
* target gain at fz1
* zero frequency(Hz)
* pole frequency(Hz)
* max ouput voltage(V)
* min output voltage(V)
* open loop gain
* feedback
* reference
.ic V(ve)=0
* 2024-12-29
.ends type2

.subckt contactor in a b
S1 b a in 0 CSW
.param ron=1u
.param roff=1Gig
.model CSW SW(VT=0.5 Ron={ron} Roff={roff})
* Contactor
* on resistance
* off resistance
* binary
* 1: on
* 0: off
* 2024-12-29
.ends contactor

.subckt timer out
B1 out 0 V=IF(time>=T,1,0)
.param T=1m
* Timer
* binary
* t=0
* t=T
* 2024-12-29
.ends timer

.subckt deadtime in l h
A1 in 0 0 0 0 0 N002 0 BUF
A2 in 0 0 0 0 0 N001 0 BUF TD={dt}
A3 0 N001 0 N002 0 0 h 0 AND
A4 0 N001 0 N002 0 l 0 0 OR
.param dt=10n
* Deadtime Generator
* deadtime(sec)
* hi-side
* lo-side
* in
* h
* l
* dt
* dt
* 2024-12-29
.ends deadtime

.subckt clarke a b c alpha beta zero
B1 alpha 0 V=(2/3)*(V(a)-0.5*V(b)-0.5*V(c))
B2 beta 0 V=(V(b)-V(c))/SQRT(3)
B3 zero 0 V=(V(a)+V(b)+V(c))/3
* Clarke Transform
* zero sequence
* α
* β
* 2024-12-29
.ends clarke

.subckt park alpha beta theta zin d q zout
B1 d 0 V=V(alpha)*cos(V(theta))+V(beta)*sin(V(theta))
B2 q 0 V=-V(alpha)*sin(V(theta))+V(beta)*cos(V(theta))
B3 zout 0 V=V(zin)
* Park Transform
* α
* β
* zero state
* angle(rad)
* zero state
.ends park

.subckt angle alpha beta theta
B1 atan 0 V=atan2(V(beta),V(alpha))
B2 theta 0 V=IF(V(atan)>0,V(atan),V(atan)+2*PI)
* α
* β
* α-β Angle Calculator
* angle(rad)
* 2024-12-29
.ends angle

.subckt sum in1 in2 out
B1 OUT 0 V=V(IN1)+V(IN2)
* SUM
* 2024-12-29
.ends sum

.subckt gain in out
B1 out 0 V={G}*V(in)
.param G=1
* GAIN
* 2024-12-29
.ends gain

.subckt parkinv d q theta zin alpha beta zout
B1 alpha 0 V=V(d)*cos(V(theta))-V(q)*sin(V(theta))
B2 beta 0 V=V(d)*sin(V(theta))+V(q)*cos(V(theta))
B3 zout 0 V=V(zin)
* Inverse Park Transform
* zero state
* angle(rad)
* zero state
.ends parkinv

.subckt clarkeinv alpha beta zero a b c
B1 a 0 V=V(alpha)+V(zero)
B2 b 0 V=-0.5*V(alpha)+0.5*SQRT(3)*V(beta)+V(zero)
B3 c 0 V=-0.5*V(alpha)-0.5*SQRT(3)*V(beta)+V(zero)
* Inverse Clarke Transform
* 2024-12-29
.ends clarkeinv

.subckt mul in1 in2 out
B1 OUT 0 V=V(IN1)*V(IN2)
R1 IN1 0 1Meg
R2 IN2 0 1Meg
* Multiplier
.ends mul

.subckt inverse in out
B1 out 0 V=IF(V(in)>0,IF(V(in)>(1/{vsat}),1/V(in),{vsat}),IF(V(in)>(-1/{vsat}),-{vsat},1/V(in)))
C1 out 0 10p Rser=1k
* Inverse
* 2025-2-23
.param vsat=1k
* saturation voltage
* <Revision History>
* 2025-01-03: Initial Versoin.
* 2025-02-23: Added RC snubber(10pF-1kohm) at output to reduce spike
.ends inverse

.subckt sv_pwm a b c a_ b_ c_ sa sb sc
B1 min 0 V=min(min(V(a),V(b)),V(c))
B2 max 0 V=max(max(V(a),V(b)),V(c))
B3 vcm 0 V=(V(min)+V(max))/2
B4 a_ 0 V=(V(a)-V(vcm))*IF(ug==1,1,2/SQRT(3))+V(z)
B5 b_ 0 V=(V(b)-V(vcm))*IF(ug==1,1,2/SQRT(3))+V(z)
B6 c_ 0 V=(V(c)-V(vcm))*IF(ug==1,1,2/SQRT(3))+V(z)
B7 z 0 V=(V(a)+V(b)+V(c))/3
X§X1 a_ sa pwm params: tri=0 freq={freq} phase=0
X§X2 b_ sb pwm params: tri=0 freq={freq} phase=0
X§X3 c_ sc pwm params: tri=0 freq={freq} phase=0
* SV_PWM
* 2026-09-21
.param freq=10k
.param ug=0
* switching frequency
* 0: gain = 2/sqrt(3) (default), 1: gain = 1
* <Revision History>
* 2025-01-04: Initial version
* 2026-09-21: Added ug parameter to select unity gain (ug=1) or retain the original 2/sqrt(3) scaling (ug=0, default).
.ends sv_pwm

.subckt pwm duty pwm
R2 c 0 1k
A1 c 0 0 0 0 0 pwm 0 BUF
V1 saw 0 PULSE(0 1 {phase/(360*freq)} {IF(tri==0,1/freq-1n,1/(2*freq))} {IF(tri==0,0.5n,1/(2*freq))} {IF(tri==0,0.5n,0)} {1/freq})
.machine
.state LO 0
.state HI 1
.rule HI LO V(saw)>V(duty)
.rule LO HI V(saw)< V(duty)
.output (c) state
.endmachine
.param freq=100k
.ic V(pwm)=0
.param phase=0
* Pulse Width Modulator
* 2026-09-21
* frequency(Hz)
.param tri=0
* 0: Saw, 1; Triangular
* phase(deg)
* <Revision History>
* 2024-12-29: Initial version
* 2026-09-21: Added tri parameter to select a triangular carrier (tri=1) or retain the original sawtooth carrier (tri=0, default).
.ends pwm

* Three Phase Input Totempole Brigeless Boost PFC, Voltage Oriented Control w/ SV-PWM
.tran 0 70m 0 10n
.ic V(link)=600
.save V(link) V(sw1) V(sw2) V(sw3) V(ea) V(eb) V(ec) V(N) I(L1) I(L2) I(L3) V(idref) V(id) V(iq) V(da) V(db) V(dc) V(da_) V(db_) V(dc_) V(vd) V(vq)
* Clarke
* Park
* Clarke
* 2025-1-4
* Inverse
* Park
* Inverse
* Clarke
* ωL
* -ωL
* SV-PWM
.lib UniversalOpAmp2.lib
.backanno
.end